# EAGLE design untitled (EAGLE 6.5.0)
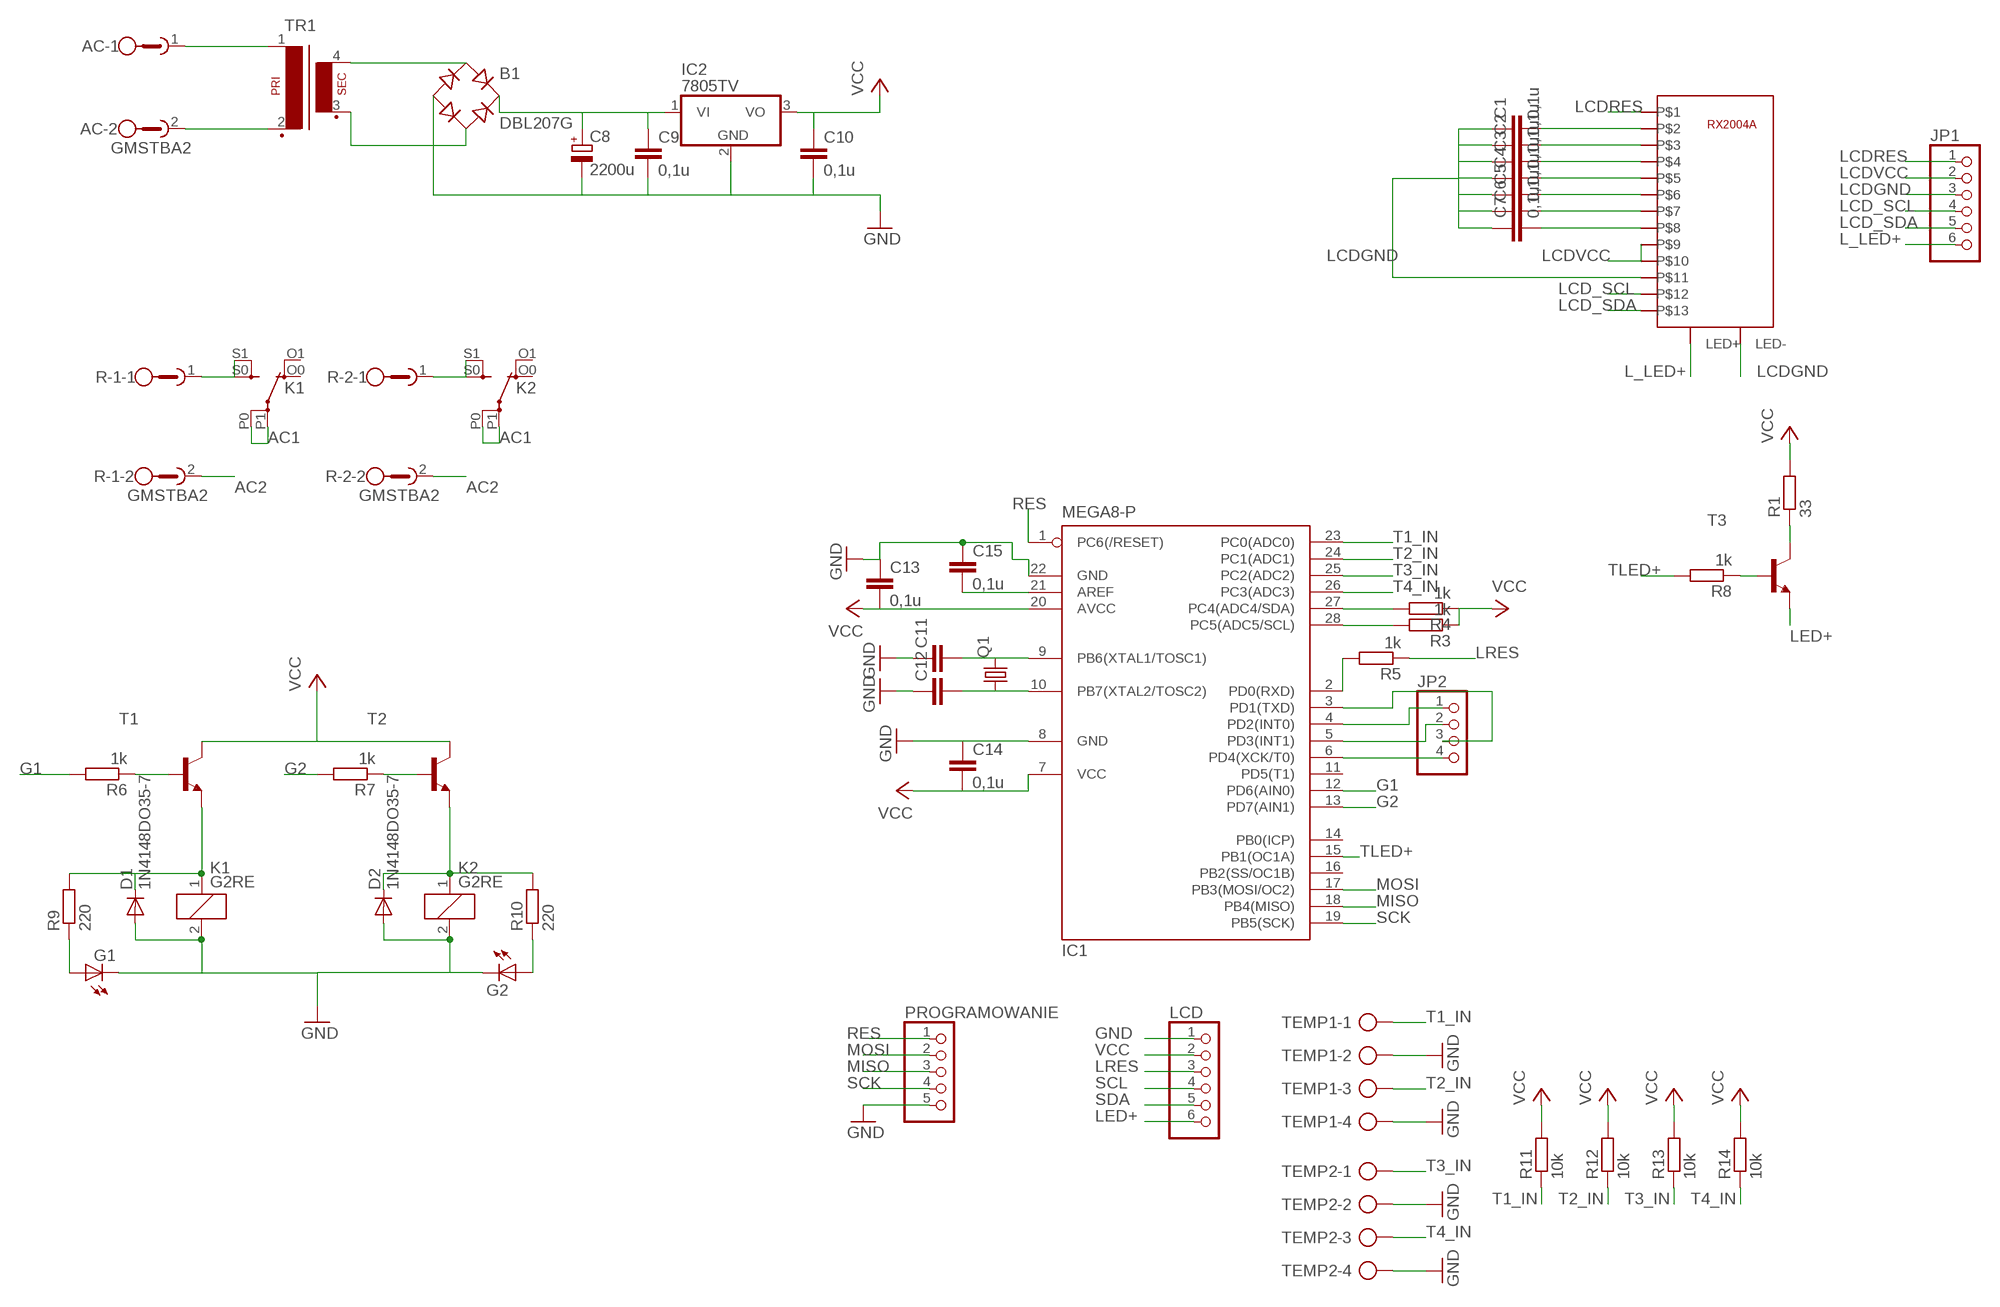
[diagram p0: schematic, sheet 1]

## Parts
AC  GMSTBA2  [GMSTBA2]
B1  DBL207G  [DB]
C1  0,1u  C-EUC1206K  [C1206K]
C2  0,1u  C-EUC1206K  [C1206K]
C3  0,1u  C-EUC1206K  [C1206K]
C4  0,1u  C-EUC1206K  [C1206K]
C5  0,1u  C-EUC1206K  [C1206K]
C6  0,1u  C-EUC1206K  [C1206K]
C7  0,1u  C-EUC1206K  [C1206K]
C8  2200u  CPOL-EUE7.5-16  [E7,5-16]
C9  0,1u  C-EUC1206K  [C1206K]
C10  0,1u  C-EUC1206K  [C1206K]
C11  C-EU025-024X044  [C025-024X044]
C12  C-EU025-024X044  [C025-024X044]
C13  0,1u  C-EUC1206K  [C1206K]
C14  0,1u  C-EUC1206K  [C1206K]
C15  0,1u  C-EUC1206K  [C1206K]
D1  1N4148DO35-7  [DO35-7]
D2  1N4148DO35-7  [DO35-7]
G1  LED3MM  [LED3MM]
G2  LED3MM  [LED3MM]
IC1  MEGA8-P  [DIL28-3]
IC2  7805TV  [TO220V]
JP1  PINHD-1X6/90  [1X06/90]
JP2  PINHD-1X4  [1X04]
K1  G2RE  [G2RE]
K2  G2RE  [G2RE]
LCD  PINHD-1X6  [1X06]
PROGRAMOWANIE  PINHD-1X5  [1X05]
Q1  CRYSTALHC49S  [HC49/S]
R1  33  R-EU_0204/7  [0204/7]
R3  1k  R-EU_0204/5  [0204/5]
R4  1k  R-EU_0204/5  [0204/5]
R5  1k  R-EU_0204/7  [0204/7]
R6  1k  R-EU_0204/5  [0204/5]
R7  1k  R-EU_0204/5  [0204/5]
R8  1k  R-EU_0204/5  [0204/5]
R9  220  R-EU_0204/7  [0204/7]
R10  220  R-EU_0204/7  [0204/7]
R11  10k  R-EU_0204/5  [0204/5]
R12  10k  R-EU_0204/5  [0204/5]
R13  10k  R-EU_0204/5  [0204/5]
R14  10k  R-EU_0204/5  [0204/5]
R-1  GMSTBA2  [GMSTBA2]
R-2  GMSTBA2  [GMSTBA2]
T1  BC337-NPN-TO92-CBE  [TO92-CBE]
T2  BC337-NPN-TO92-CBE  [TO92-CBE]
T3  BC337-NPN-TO92-CBE  [TO92-CBE]
TEMP1  AK500/4  [AK500/4]
TEMP2  AK500/4  [AK500/4]
TR1  VP31  [VP31]
U$1  RX2004A  [RX2004A]

## Nets
AC1: AC.1 K1.P0(2:P) K1.P1(2:P) K2.P0(2:P) K2.P1(2:P) TR1.1
AC2: AC.2 R-1.2 R-2.2 TR1.2
G1: IC1.12(PD6(AIN0)) R6.2
G2: IC1.13(PD7(AIN1)) R7.2
GND: B1.- C8.- C9.2 C10.2 C11.1 C12.1 C13.1 C14.1 C15.1 D1.A D2.A G1.K(C) G2.K(C) IC1.8(GND) IC1.22(GND) IC2.2(GND) K1.2 K2.2 LCD.1 PROGRAMOWANIE.5 TEMP1.2 TEMP1.4 TEMP2.2 TEMP2.4
L_LED+: JP1.6 U$1.LED+
LCD_SCL: JP1.4 U$1.P$12
LCD_SDA: JP1.5 U$1.P$13
LCDGND: C1.1 C2.1 C3.1 C4.1 C5.1 C6.1 C7.1 JP1.3 U$1.LED- U$1.P$11
LCDRES: JP1.1 U$1.P$1
LCDVCC: JP1.2 U$1.P$9 U$1.P$10
LED+: LCD.6 T3.E
LRES: LCD.3 R5.1
MISO: IC1.18(PB4(MISO)) PROGRAMOWANIE.3
MOSI: IC1.17(PB3(MOSI/OC2)) PROGRAMOWANIE.2
N$1: C1.2 U$1.P$2
N$2: C2.2 U$1.P$3
N$3: C3.2 U$1.P$4
N$4: C4.2 U$1.P$5
N$5: C5.2 U$1.P$6
N$6: C6.2 U$1.P$7
N$7: C7.2 U$1.P$8
N$8: K1.S0(2:S) K1.S1(2:S) R-1.1
N$9: C11.2 IC1.9(PB6(XTAL1/TOSC1)) Q1.2
N$10: B1.AC1 TR1.4(S4)
N$11: B1.AC2 TR1.3(S3)
N$12: C12.2 IC1.10(PB7(XTAL2/TOSC2)) Q1.1
N$13: B1.+ C8.+ C9.1 IC2.1(VI)
N$14: C15.2 IC1.21(AREF)
N$15: K2.S0(2:S) K2.S1(2:S) R-2.1
N$17: R1.1 T3.C
N$18: R6.1 T1.B
N$19: R8.1 T3.B
N$20: R7.1 T2.B
N$21: D2.C K2.1 R10.2 T2.E
N$22: IC1.4(PD2(INT0)) JP2.1
N$23: IC1.5(PD3(INT1)) JP2.2
N$24: D1.C K1.1 R9.2 T1.E
N$25: G1.A R9.1
N$26: G2.A R10.1
N$27: IC1.2(PD0(RXD)) R5.2
N$29: IC1.3(PD1(TXD)) JP2.3
N$30: IC1.6(PD4(XCK/T0)) JP2.4
RES: IC1.1(PC6(/RESET)) PROGRAMOWANIE.1
SCK: IC1.19(PB5(SCK)) PROGRAMOWANIE.4
SCL: IC1.28(PC5(ADC5/SCL)) LCD.4 R3.2
SDA: IC1.27(PC4(ADC4/SDA)) LCD.5 R4.2
T1_IN: IC1.23(PC0(ADC0)) R11.1 TEMP1.1
T2_IN: IC1.24(PC1(ADC1)) R12.1 TEMP1.3
T3_IN: IC1.25(PC2(ADC2)) R13.1 TEMP2.1
T4_IN: IC1.26(PC3(ADC3)) R14.1 TEMP2.3
TLED+: IC1.15(PB1(OC1A)) R8.2
VCC: C10.1 C13.2 C14.2 IC1.7(VCC) IC1.20(AVCC) IC2.3(VO) LCD.2 R1.2 R3.1 R4.1 R11.2 R12.2 R13.2 R14.2 T1.C T2.C
Unconnected: IC1.11(PD5(T1)) IC1.14(PB0(ICP)) IC1.16(PB2(SS/OC1B)) K1.O0(2:O) K1.O1(2:O) K2.O0(2:O) K2.O1(2:O)

## Library data of the parts
AC R-1 R-2 = con-phoenix-762:GMSTBA2: PHOENIX; MF: FARNELL; MPN: 1757242; OC_FARNELL: 3705171; OC_NEWARK: 71C4161
B1 = rectifier:DB?*G: Single Phase 1.0 AMP Glass Passivated Bridge Rectifier Taiwan Semiconductor Co.,Ltd. - TSC Source: http://www.taiwansemi.com/TSCbig5/ezcatfiles/cust/img/img/db101g.pdf http://www.ts.com.tw/db/pictures/modules/PDT/PDT060207001/DBLS201G.pdf
C1-C7 C9-C15 = rcl:C-EU: CAPACITOR, European symbol
C8 = rcl:CPOL-EU: POLARIZED CAPACITOR, European symbol
D1 D2 = diode:1N4148: DIODE high speed (Philips)
G1 G2 = led:LED: LED OSRAM: - CHIPLED LG R971, LG N971, LY N971, LG Q971, LY Q971, LO R971, LY R971 LH N974, LH R974 LS Q976, LO Q976, LY Q976 LO Q996 - Hyper CHIPLED LW Q18S LB Q993, LB Q99A, LB R99A - SideLED LS A670, LO A670, LY A670, LG A670, LP A670 LB A673, LV A673, LT A673, LW A673 LH A674 LY A675 LS A676, LA A676, LO A676, LY A676, LW A676 LS A679, LY A679, LG A679 - Hyper Micro SIDELED® LS Y876, LA Y876, LO Y876, LY Y876 LT Y87S - SmartLED LW L88C, LW L88S LB L89C, LB L89S, LG L890 LS L89K, LO L89K, LY L89K LS L896, LA L896, LO L896, LY L896 - TOPLED LS T670, LO T670, LY T670, LG T670, LP T670 LSG T670, LSP T670, LSY T670, LOP T670, LYG T670 LG T671, LOG T671, LSG T671 LB T673, LV T673, LT T673, LW T673 LH T674 LS T676, LA T676, LO T676, LY T676, LB T676, LH T676, LSB T676, LW T676 LB T67C, LV T67C, LT T67C, LS T67K, LO T67K, LY T67K, LW E67C LS E67B, LA E67B, LO E67B, LY E67B, LB E67C, LV E67C, LT E67C LW T67C LS T679, LY T679, LG T679 LS T770, LO T770, LY T770, LG T770, LP T770 LB T773, LV T773, LT T773, LW T773 LH T774 LS E675, LA E675, LY E675, LS T675 LS T776, LA T776, LO T776, LY T776, LB T776 LHGB T686 LT T68C, LB T68C - Hyper Mini TOPLED® LB M676 - Mini TOPLED Santana® LG M470 LS M47K, LO M47K, LY M47K Source: http://www.osram.convergy.de LUXEON: - LUMILED® LXK2-PW12-R00, LXK2-PW12-S00, LXK2-PW14-U00, LXK2-PW14-V00 LXK2-PM12-R00, LXK2-PM12-S00, LXK2-PM14-U00 LXK2-PE12-Q00, LXK2-PE12-R00, LXK2-PE12-S00, LXK2-PE14-T00, LXK2-PE14-U00 LXK2-PB12-K00, LXK2-PB12-L00, LXK2-PB12-M00, LXK2-PB14-N00, LXK2-PB14-P00, LXK2-PB14-Q00 LXK2-PR12-L00, LXK2-PR12-M00, LXK2-PR14-Q00, LXK2-PR14-R00 LXK2-PD12-Q00, LXK2-PD12-R00, LXK2-PD12-S00 LXK2-PH12-R00, LXK2-PH12-S00 LXK2-PL12-P00, LXK2-PL12-Q00, LXK2-PL12-R00 Source: www.luxeon.com KINGBRIGHT: KA-3528ASYC Source: www.kingbright.com
IC1 = atmel:MEGA8-P: MICROCONTROLLER 8 Kbytes FLASH, 1 kbytes SRAM, 512 bytes EEPROM, USART, 4-channel 10 bit ADC, 2-channel 8 bit ADC Pin compatible with Atmega48, ATMega88, ATMega168 Source: avr.lbr; OC_FARNELL: unknown; OC_NEWARK: unknown
IC2 = linear:78*: Positive VOLTAGE REGULATOR Source: http://cache.national.com/ds/LM/LM78L05.pdf http://www.fairchildsemi.com/ds/LM/LM7805.pdf
JP1 LCD = pinhead:PINHD-1X6: PIN HEADER
JP2 = pinhead:PINHD-1X4: PIN HEADER
K1 K2 = relay:G2RE: RELAY 1 x switch, high current, Omron; OC_FARNELL: unknown; OC_NEWARK: unknown
PROGRAMOWANIE = pinhead:PINHD-1X5: PIN HEADER
Q1 = crystal:CRYSTAL: CRYSTAL; OC_FARNELL: 1667008; OC_NEWARK: unknown
R1 R3-R14 = rcl:R-EU_: RESISTOR, European symbol
T1-T3 = transistor:*-NPN-: NPN Transistror BF959 corrected 2008.03.06
TEMP1 TEMP2 = con-ptr500:AK500/4: CONNECTOR; OC_FARNELL: unknown; OC_NEWARK: unknown
TR1 = trafo:VP31: TRANSFORMER 1 primary winding, 1 secondary winding BLOCK
U$1 = RX2004A:RX2004A

## Board
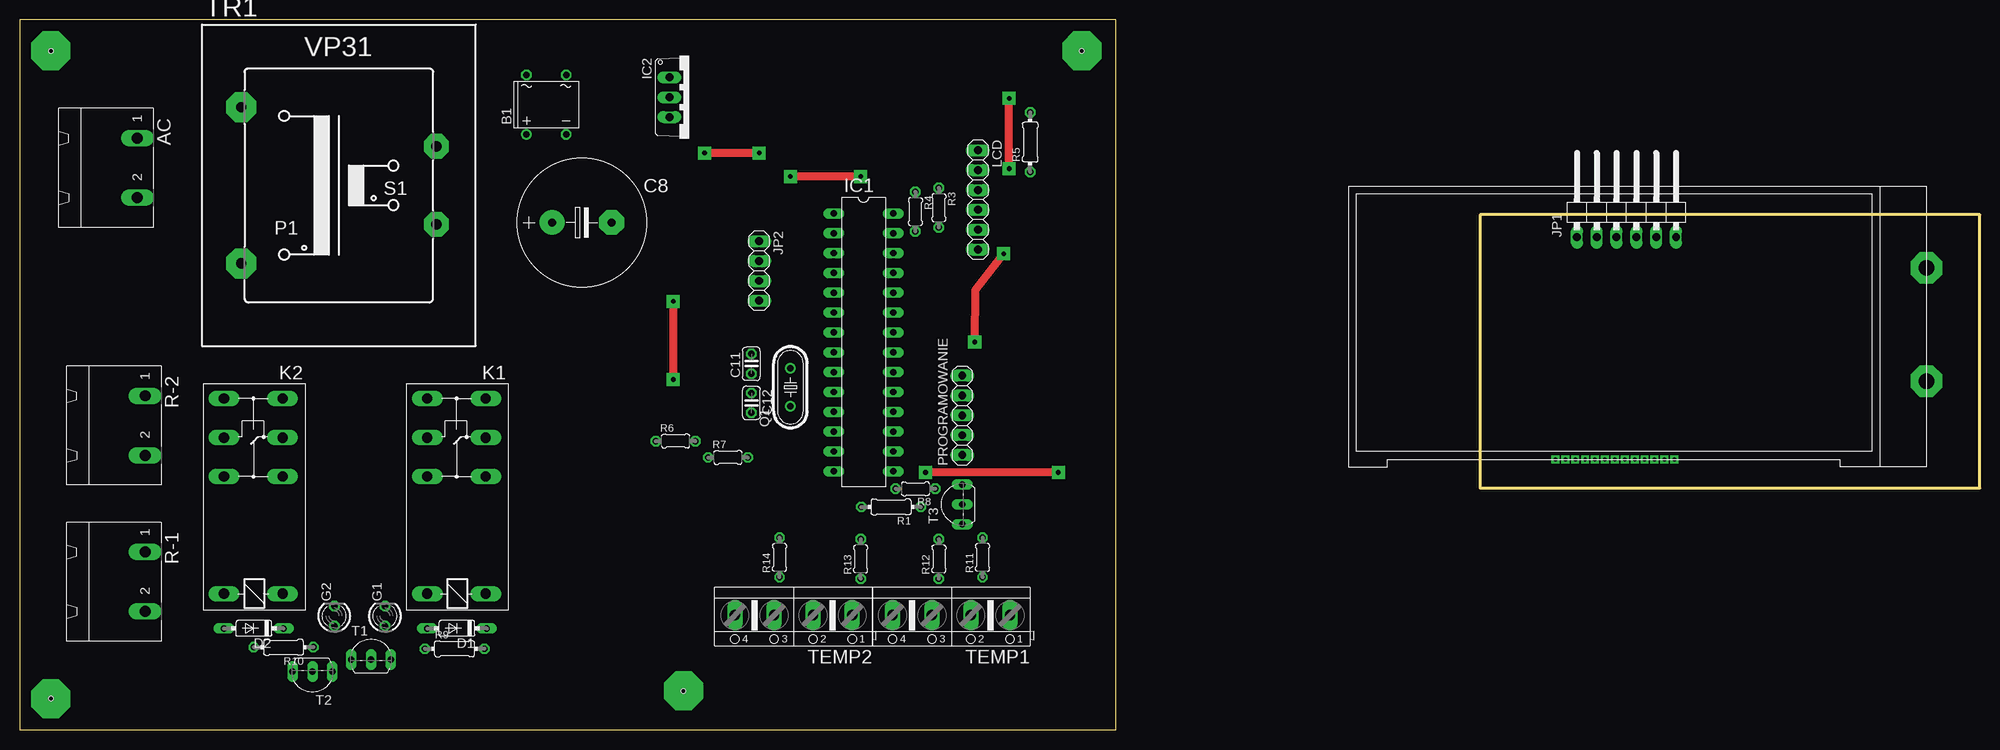
[diagram p1: board, top side]
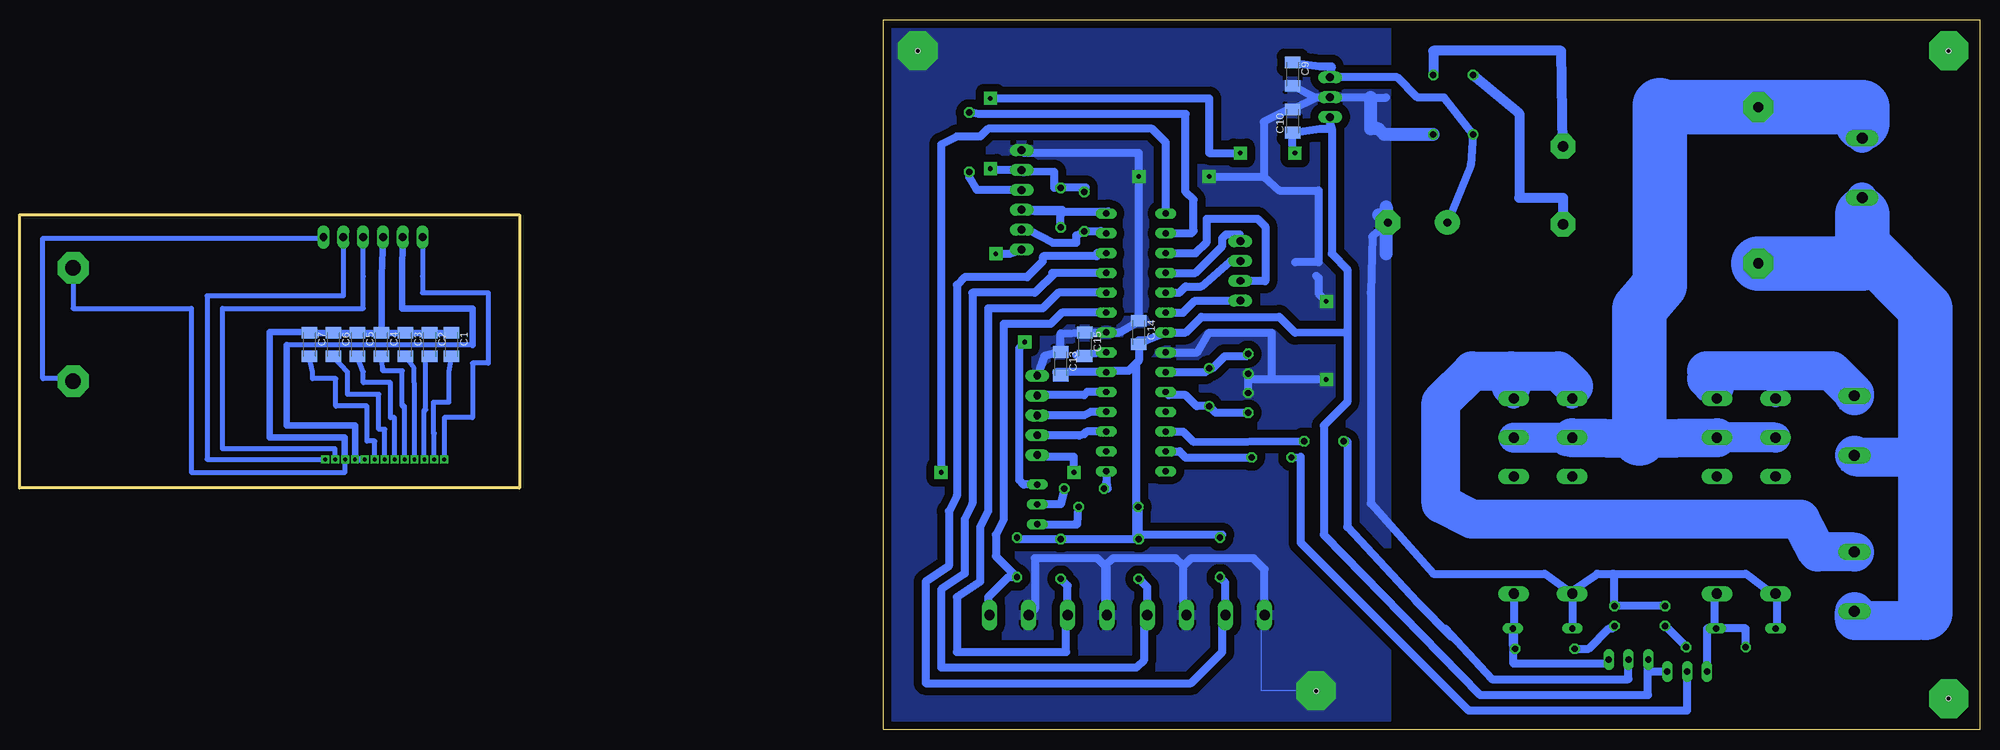
[diagram p2: board, bottom side, seen from below]

Size 251 x 91 mm. Coordinates in mm from the lower left corner, seen from the top.
Outline: 0,0 140.4,0 140.4,91 0,91 0,0
Outline: 251,66 187,66 187,31 251,31 251,66
Copper layers (1*16): Top 0.035mm / dielectric 1.5mm / Bottom 0.035mm
Design rules "default": minimum track width 10mil, minimum drill 24mil, track to track 8mil, track to pad 8mil, pad to pad 8mil, via to via 8mil, smd to smd 8mil, copper to edge 40mil, drill to drill 8mil, minimum pad ring 10mil, minimum via ring 8mil, stop-mask expansion 4mil, vias tented up to drill 0mil, thermal gap 10mil
Holes 0.6 mm at 4,87 4,4 85,5 136,87

### Footprints (pad centres in the part's own frame; a part is rotated, then mirrored left to right if it is on the bottom)
GMSTBA2 = drill 1.397 long: 1 -3.81,5.08; 2 3.81,5.08
DB = drill 0.813: + -2.54,-3.81 | drill 0.813 octagon: - 2.54,-3.81; AC1 2.54,3.81; AC2 -2.54,3.81
C1206K = smd 1.5 x 2: 1 -1.5,0; 2 1.5,0
E7,5-16 = drill 1.016 pad 3.15: + -3.81,0 | drill 1.016 pad 3.15 octagon: - 3.81,0
C025-024X044 = drill 0.813 octagon: 1 -1.27,0; 2 1.27,0
DO35-7 = drill 0.813 long: A 3.81,0; C -3.81,0
LED3MM = drill 0.813 octagon: A -1.27,0; K 1.27,0
DIL28-3 = drill 0.813 long: 1 -16.51,-3.81; 2 -13.97,-3.81; 3 -11.43,-3.81; 4 -8.89,-3.81; 5 -6.35,-3.81; 6 -3.81,-3.81; 7 -1.27,-3.81; 8 1.27,-3.81; 9 3.81,-3.81; 10 6.35,-3.81; 11 8.89,-3.81; 12 11.43,-3.81; 13 13.97,-3.81; 14 16.51,-3.81; 15 16.51,3.81; 16 13.97,3.81; 17 11.43,3.81; 18 8.89,3.81; 19 6.35,3.81; 20 3.81,3.81; 21 1.27,3.81; 22 -1.27,3.81; 23 -3.81,3.81; 24 -6.35,3.81; 25 -8.89,3.81; 26 -11.43,3.81; 27 -13.97,3.81; 28 -16.51,3.81
TO220V = drill 1.016 long: 1 -2.54,-2.54; 2 0,-2.54; 3 2.54,-2.54
1X06/90 = drill 1.016 long: 1 -6.35,-3.81; 2 -3.81,-3.81; 3 -1.27,-3.81; 4 1.27,-3.81; 5 3.81,-3.81; 6 6.35,-3.81
1X04 = drill 1.016 long: 1 -3.81,0; 2 -1.27,0; 3 1.27,0; 4 3.81,0
G2RE = drill 1.321 long: 1 -2.54,-3.683; 2 -2.54,3.81; O0 12.471,-3.683; O1 12.471,3.81; P0 17.45,-3.683; P1 17.45,3.81; S0 22.454,-3.683; S1 22.454,3.81
1X06 = drill 1.016 long: 1 -6.35,0; 2 -3.81,0; 3 -1.27,0; 4 1.27,0; 5 3.81,0; 6 6.35,0
1X05 = drill 1.016 long: 1 -5.08,0; 2 -2.54,0; 3 0,0; 4 2.54,0; 5 5.08,0
HC49/S = drill 0.813: 1 -2.413,0; 2 2.413,0
0204/7 = drill 0.813 octagon: 1 -3.81,0; 2 3.81,0
0204/5 = drill 0.813 octagon: 1 -2.54,0; 2 2.54,0
TO92-CBE = drill 0.813 long: B 0,0; C -2.54,0; E 2.54,0
AK500/4 = drill 1.321 long: 1 -7.518,0; 2 -2.489,0; 3 2.489,0; 4 7.518,0
VP31 = drill 1.321 pad 3.81 octagon: 1 -12.497,10.008; 2 -12.497,-10.008 | drill 1.321 pad 3.175 octagon: 3 12.497,-5.004; 4 12.497,5.004
RX2004A = drill 2 pad 4 octagon: LED+ 44,-5; LED- 44,9.5 | drill 0.5 square: P$1 -3.51,-15.01; P$2 -2.24,-15.01; P$3 -0.97,-15.01; P$4 0.3,-15.01; P$5 1.57,-15.01; P$6 2.84,-15.01; P$7 4.11,-15.01; P$8 5.38,-15.01; P$9 6.65,-15.01; P$10 7.92,-15.01; P$11 9.19,-15.01; P$12 10.46,-15.01; P$13 11.73,-15.01

### Placement (x,y rotation side)
AC  10,72 270 top
B1  67.45,80.09 0 top
C1  195.69,49.36 270 bottom
C2  198.5,49.36 270 bottom
C3  201.58,49.36 270 bottom
C4  204.66,49.36 270 bottom
C5  207.74,49.36 270 bottom
C6  210.82,49.36 270 bottom
C7  213.9,49.36 270 bottom
C8  72,65 0 top
C9  88,84 270 bottom
C10  88,78 90 bottom
C11  93.7,46.9 90 top
C12  93.7,41.9 270 top
C13  117.7,46.9 270 bottom
C14  107.7,50.9 270 bottom
C15  114.6,49.4 270 bottom
D1  56,13 180 top
D2  30,13 180 top
G1  46.8,14.6 90 top
G2  40.3,14.6 90 top
IC1  108.05,49.65 270 top
IC2  85.75,81.05 270 top
JP1  205.74,66.94 0 top
JP2  94.7,58.8 270 top
K1  56,20 90 top
K2  30,20 90 top
LCD  122.7,67.9 270 top
PROGRAMOWANIE  120.7,40.3 90 top
Q1  98.7,43.9 90 top
R1  111.58,28.57 180 top
R3  117.7,66.9 270 top
R4  114.7,66.4 270 top
R5  129.4,75.3 90 top
R6  84,37 0 top
R7  90.7,34.9 0 top
R8  114.7,30.9 180 top
R9  55.7,10.4 0 top
R10  33.8,10.6 180 top
R11  123.3,22.1 90 top
R12  117.7,21.9 90 top
R13  107.7,21.9 90 top
R14  97.3,22.1 90 top
R-1  11,19 270 top
R-2  11,39 270 top
T1  45,9 0 top
T2  37.5,7.5 180 top
T3  120.7,28.9 90 top
TEMP1  119.3,14.7 180 top
TEMP2  99.1,14.7 180 top
TR1  40.88,69.76 0 top
U$1  200.14,49.68 0 top

### Tracks (layer width: path | path; a pad name or v marks a point on that pad's centre or on a via)
AC1
  Bottom 3.81: K2.P1 K2.P0 | K1.P0 53.45,37.45 53,37 52.64,37 K1.P1 | 15.1,77.7 AC.1
  Bottom 5: K1.P1 43.6,37.35 K2.P0 | 40.77,79.77 41,80
  Bottom 7: 40.77,79.77 TR1.1 15.1,79.77 15.1,77.7 | 41,80 41,57 43.6,53.9 43.6,37.35
AC2
  Bottom 3.81: 15.1,66 AC.2 15.08,62.08
  Bottom 5: R-2.2 15.89,35 7,35 | 7,15 8,14 16,14 16.08,14.08 R-1.2
  Bottom 7: 15.1,66 15.1,59.75 TR1.2 | 15.08,62.08 7,54 7,35 7,15
G1
  Bottom 1.016: IC1.12 102.02,38.22 100.7,36.9 R6.2
G2
  Bottom 1.016: IC1.13 102.48,35.68 101.7,34.9 R7.2
GND  (via drill 0.6 pad 1.68, 0.6 pad 5)
  Top 1.016: v83.7,54.9 v83.7,44.9 | v107.7,70.9 v98.7,70.9
  Bottom 0.1: v85,5 92,5 92,14.7 | TEMP2.4 92,14.7 | 92,14.7 92,15
  Bottom 1.016: 76,81 78,81 78.16,81 IC2.2 78.26,81 85,81 | C9.2 85,81 | 85,81 C10.2 88.5,79.5 91.7,77.9 91.7,70.9 | C8.- 77.81,63.19 78,56 78,29 70,20 55.73,20 K1.2 | K1.2 D1.A | K1.2 52.19,17.81 49,20 47,20 | 47,20 30,20 26,17 | 26,17 26,13.19 D2.A | 26,17 26,17.27 K2.2 | C11.1 93.7,44.9 | 93.7,44.9 C12.1 | IC1.8 100.22,48.38 98.7,50.9 90.7,50.9 90.7,44.9 | 90.7,44.9 93.7,44.9 | 91.7,70.9 89.7,69.1 84.7,69.1 84.7,59.9 87.7,59.9 | PROGRAMOWANIE.5 119.78,47.9 C13.1 117.7,50.8 C15.1 112.24,50.9 IC1.22 110.18,50.92 C14.1 v107.7,70.9 107.7,73.9 122.35,73.9 LCD.1 | 84.97,58.17 84.7,57.9 84.7,55.9 v83.7,54.9 | v83.7,44.9 90.7,44.9 | v98.7,70.9 91.7,70.9 | TEMP2.4 91.58,20.58 93,22 101,22 102,21 | TEMP2.2 102,15.11 102,21 | 102,21 103,22 111,22 112,21 112,14.92 TEMP1.4 111.78,20.78 113,22 121,22 121,15.49 TEMP1.2 | G2.K G1.K 46.8,19.8 47,20
  Bottom 1.676: B1.- 76.28,76.28 77,77 78,77 78,81 | 76,61 76,66 | 76,67 76,66 | C8.- 76,65 77,66 76,66
  other vias: 136,87
  pour Bottom (isolate 1.016): 76,91 140.7,91.1 140.7,0.1 76,0
L_LED+
  Bottom 0.61: U$1.LED+ 244.14,45 248,45 248,63 212,63 212,63.13 JP1.6
LCD_SCL
  Bottom 0.61: U$1.P$12 210.6,36 225,36 225,54 207,54 207,58.13 JP1.4
LCD_SDA
  Bottom 0.61: JP1.5 209.55,55.6 227,55.6 227,34.67 U$1.P$13
LCDGND
  Bottom 0.61: U$1.LED- 244.14,54 229,54 229,33 209.33,33 U$1.P$11 209.4,34.67 | 213.9,51 C7.1
  Bottom 0.813: C1.1 C2.1 C3.1 C4.1 | C4.1 C5.1 C6.1 C7.1 | 209.4,34.67 209.4,37.5 219,37.5 219,51 213.9,51 | JP1.3 204.66,58.13 C4.1
LCDRES
  Bottom 0.61: JP1.1 199.4,58.13 199.4,56 191,56 191,47 193,47 193,40 196.63,40 U$1.P$1
LCDVCC
  Bottom 0.61: 193,49.3 216.8,49.3
  Bottom 0.813: 216.8,49.3 216.8,39 208.06,39 U$1.P$10 U$1.P$9 | JP1.2 202,58.13 202,54 193,54 193,49.3
LED+  (via drill 0.6 pad 1.68)
  Top 1.016: v122.3,49.7 122.4,56.4 v126,61
  Bottom 1.016: T3.E 122.44,31.44 123,32 123,48.9 v122.3,49.7 | v126,61 124.25,61 LCD.6
LRES
  Bottom 1.016: LCD.3 128.43,69.17 129.4,70.8 R5.1
MISO
  Bottom 1.016: IC1.18 113.84,40.76 114.7,40.3 PROGRAMOWANIE.3
MOSI
  Bottom 1.016: IC1.17 114.38,38.22 114.7,37.9 114.8,37.9 115.3,37.7 120.66,37.7 PROGRAMOWANIE.2
N$1
  Bottom 0.61: U$1.P$2 197.9,38 198,38 198,42 196,42 196,45.86 C1.2
N$2
  Bottom 0.61: U$1.P$3 199.17,41 199,41 199,47.86 C2.2
N$3
  Bottom 0.61: U$1.P$4 200.44,43 200.5,46 200.5,46.36 C3.2
N$4
  Bottom 0.61: U$1.P$5 201.71,41.5 202,41.5 202,46 204.5,46 204.5,46.36 C4.2
N$5
  Bottom 0.61: U$1.P$6 202.98,40 203.5,40 203.5,44.5 207,44.5 207,45.86 C5.2
N$6
  Bottom 0.61: U$1.P$7 204.25,38.5 205,38.5 205,43 209,43 209,45.86 C6.2
N$7
  Bottom 0.61: U$1.P$8 205.52,37 206.5,37 206.5,41.5 210.5,41.5 210.5,45 213.5,45 213.5,45.86 C7.2
N$8
  Bottom 2.54: 52,44 52,42.64 K1.S1 | K1.S0 59.68,42.68 60,44
  Bottom 5: R-1.1 20.81,22.81 23,27 65,27 69,29 69,42 65,46 60,46 | 60,46 54,46 52,44 | 60,44 60,46
N$9
  Bottom 1.016: IC1.9 99.17,45.84 Q1.2 98.29,46.31 96.7,47.9 93.97,47.9 C11.2
N$10
  Bottom 1.016: B1.AC1
  Bottom 1.27: TR1.4 53.6,86.99 70,87 B1.AC1
N$11
  Bottom 1.27: B1.AC2 59,79 59,68.19 53.38,68.19 TR1.3
N$12
  Bottom 1.016: C12.2 97.84,40.63 Q1.1 100.29,41.49 101.7,42.9 103.84,42.9 IC1.10
N$13
  Bottom 1.016: C8.+ 65.19,72.38 B1.+ 68.63,81 72,81 74.59,83.59 IC2.1 83.21,84.21 83,85 84.5,85 C9.1
N$14
  Bottom 1.016: IC1.21 115.68,47.98 C15.2
N$15
  Bottom 1.93: 34,44 34,42.77 K2.S0
  Bottom 2.184: K2.S1 26.19,44.81 26,45 26,46
  Bottom 5: 16.2,42.93 R-2.1 16.08,43.08 19,46 26,46 35,46 35,45 34,44
N$16  (via drill 0.6 pad 5)
  other vias: 4,87
N$17
  Bottom 1.016: T3.C 115.57,26.36 R1.1
N$18
  Bottom 1.016: R6.1 81,37 81,26 72.1,16.4 67.6,11.9 68.5,13 62.5,6.5 45,6.5 T1.B
N$19
  Bottom 1.016: R8.1 117.7,28.9 T3.B
N$20
  Bottom 1.016: R7.1 87,35 87,24 65.5,2.5 37.5,2.5 T2.B
N$21
  Bottom 1.016: K2.1 33.68,17.32 34,17 34,13.19 D2.C | D2.C 34.96,13 T2.E | R10.2 29.99,12.99 30,13 D2.C
N$22
  Bottom 1.016: IC1.4 100.46,58.54 97,62 97,63 96.5,63.5 94.81,63.5 JP2.1
N$23
  Bottom 1.016: IC1.5 102.5,56 101.7,56.8 99.7,56.8 96,60 95.27,60 JP2.2
N$24
  Bottom 1.016: T1.E 47.5,8.5 59.71,8.5 D1.C 59.68,13.13 K1.1 59.68,10.57 R9.2
N$25
  Bottom 1.016: R9.1 50.1,10.4 47.5,13 47.13,13 G1.A
N$26
  Bottom 1.016: R10.1 37.61,10.64 G2.A
N$27
  Bottom 1.016: IC1.2 100.98,63.62 100.7,63.9 100.7,67.9 101.7,68.9 101.7,78.9 128.16,78.9 R5.2
N$28  (via drill 0.6 pad 5)
  other vias: 4,4 4,4
N$29
  Bottom 1.016: IC1.3 100.42,61.08 99,62.5 99,65.5 92.5,65.5 91.5,64.5 91.5,57.5 95.17,57.5 JP2.3
N$30
  Bottom 1.016: IC1.6 102.04,53.46 100.5,55 96.19,55 JP2.4
RES  (via drill 0.6 pad 1.68)
  Top 1.016: v133,33 v116,33
  Bottom 1.016: IC1.1 104.24,75.24 106,77 127,77 128,76 131,76 133,75 v133,33 | v116,33 116,35 120.52,35 PROGRAMOWANIE.1
SCK
  Bottom 1.016: IC1.19 114.3,43.3 114.7,42.9 120.24,42.9 PROGRAMOWANIE.4
SCL
  Bottom 1.016: 117.7,65.9 R3.2 117.7,66.4 | 117.7,66.4 120.93,66.4 LCD.4 117.47,66.63 117.7,66.4 | 117.7,66.4 111.6,66.4 IC1.28
SDA
  Bottom 1.016: LCD.5 121.89,64.09 118.7,62.4 115.7,62.4 115.7,63.36 R4.2 114.7,63.9 112.58,63.9 IC1.27
T1_IN
  Bottom 1.016: TEMP1.1 127,14.88 127,17 124.44,19.56 R11.1 126,22.26 126,25 125,27 125,52 119,52 117.54,53.46 IC1.23
T2_IN
  Bottom 1.016: R12.1 116.81,18.47 TEMP1.3 117,14.51 117,10 131,10 131,17 128,19 128,26 127,28 127,54 120,54 118,56 IC1.24
T3_IN
  Bottom 1.016: R13.1 106.62,18.28 TEMP2.1 107,14.32 107,9 108,8 133,8 133,18 130,20 130,27 129,29 129,56 121,56 118.46,58.54 | IC1.25 118.46,58.54 | 118.76,58.24 118.76,58.54 118.46,58.54
T4_IN
  Bottom 1.016: R14.1 96.61,18.87 TEMP2.3 97,14.31 97,10 101,6 135,6 135,19 132,21 132,28 131,30 131,57 130,58 122,58 120,60 120,60.5 119.92,60.68 113.1,60.7 113.1,61.08 IC1.26
TLED+
  Bottom 1.016: IC1.15 111.86,31.74 111.7,30.9 R8.2
VCC  (via drill 0.6 pad 1.68)
  Top 1.016: v126.7,71.9 v126.7,80.9 | v94.7,73.9 v87.7,73.9
  Bottom 1.016: 83,77 84.5,77 C10.1 88,73.9 v87.7,73.9 | 83,77 83.21,77.79 IC2.3 | T2.C 42.5,7.5 T1.C 42.5,9.54 42.5,4.5 64,4.5 84,25 84,39 81,42 81,51 | C13.2 118.26,45.84 IC1.20 111.7,46 109,46 108,47 | R4.1 114.5,68.94 114.5,69.5 R3.1 118.5,69.44 118.5,71.5 122.43,71.44 LCD.2 126.51,71.71 v126.7,71.9 | 83,77 83,61 81,59 81,51 | 81,51 87.7,50.9 89.7,52.9 99.7,52.9 101.68,50.92 IC1.7 106.68,49.92 107.7,49.9 C14.2 107.7,47.3 108,47 | v126.7,80.9 98.7,80.9 98.7,73.9 v94.7,73.9 | R14.2 97.3,24.7 97,25 107.14,25 | 107.14,25 R13.2 | R13.2 R12.2 123.1,24.44 R11.2 | R1.2 107.77,24.51 R13.2 | 107.14,25 108,25 108,47

### Text on the board
tTest: GND | AC | VCC | LRES | SCL | SDA | SW1 | LED+ | SW2 | I/O-1 | I/O-2 | GRZALKA 2 | GND | SCK | MISO | MOSI | RES | GRZALKA 1 | T4 | T3 | T2 | T1
bTest: LRES | VCC | GND | SCL | SDA | LED+